# Altium schematic sheet Microcontroller.SchDoc
size A; SheetNumber: 1; SheetTotal: 9
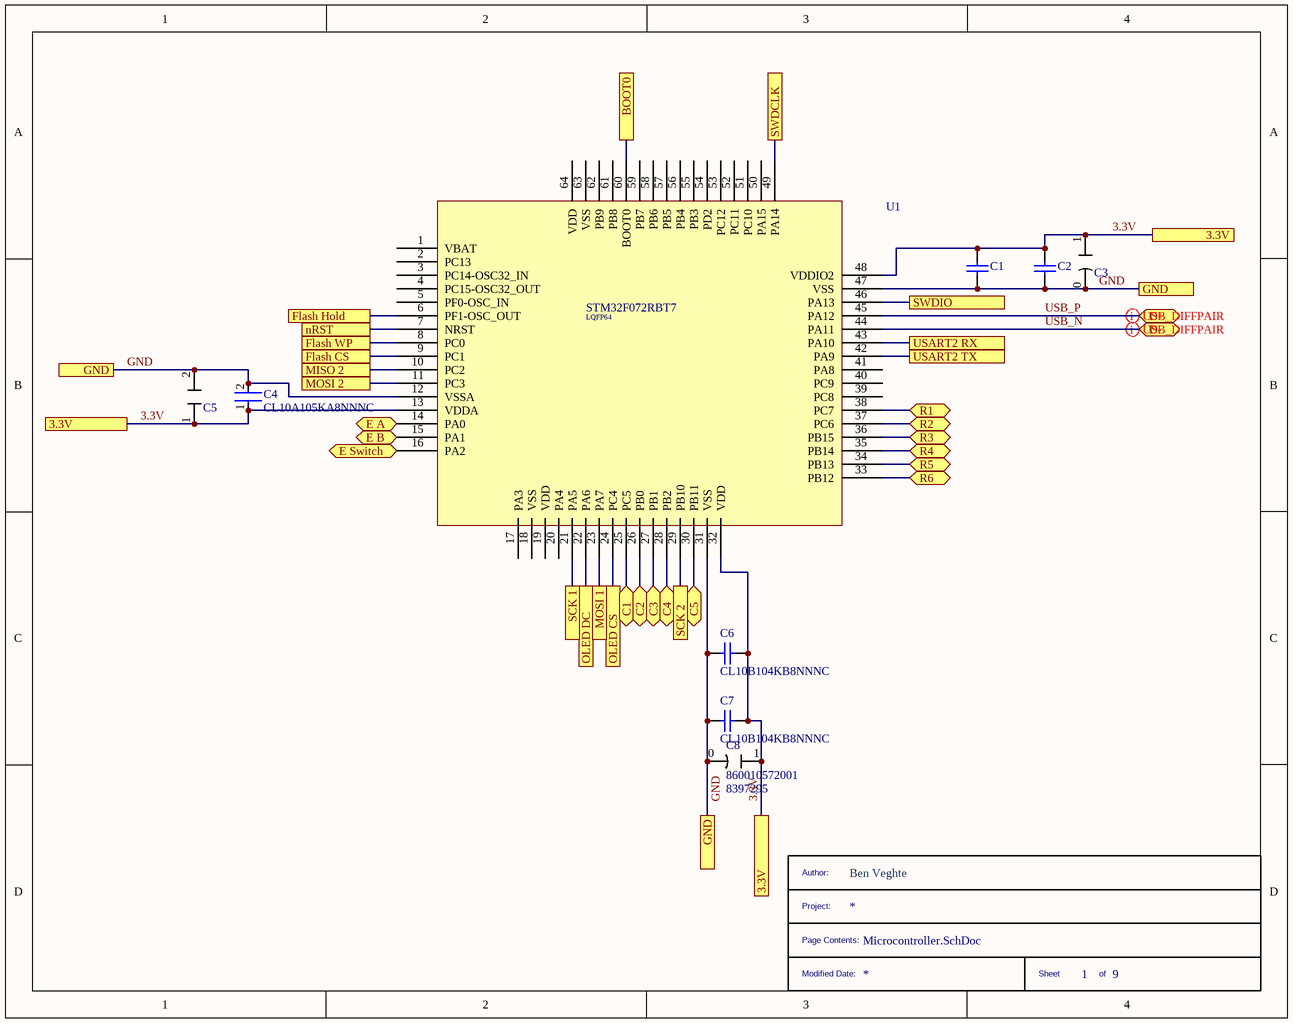
[diagram p0: Microcontroller.SchDoc]

## Parts
*  __TITLE_BLOCK__  (value not drawn)  (graphical)
C1  CL10B104KB8NNNC  [SAMS-C0603-2_M]  (value not drawn)
C2  CL10B104KB8NNNC  [SAMS-C0603-2_M]  (value not drawn)
C3  860010572001  [860010572001]  (value not drawn)
C4  CL10A105KA8NNNC  [FP-CL10-IPC_C]
C5  CL10B103KB8NNNC  [CL10B103KB8NNNC]  (value not drawn)
C6  CL10B104KB8NNNC  [SAMS-C0603-2_M]
C7  CL10B104KB8NNNC  [SAMS-C0603-2_M]
C8  860010572001  Supplier Part Number 1: 8397295  [860010572001]
U1  STM32F072RBT7  [STM32F072RBT6]  (value not drawn)

## Ports
3.3V, BOOT0, C1 (bidir), C2 (bidir), C3 (bidir), C4 (bidir), C5 (bidir), D+ (bidir), D- (bidir), E A (bidir), E B (bidir), E Switch (bidir), Flash CS, Flash Hold, Flash WP, GND, MISO 2, MOSI 1, MOSI 2, nRST, OLED CS, OLED DC, R1 (bidir), R2 (bidir), R3 (bidir), R4 (bidir), R5 (bidir), R6 (bidir), SCK 1, SCK 2, SWDCLK, SWDIO, USART2 RX, USART2 TX

## Nets
3.3V: C1.2 C2.2 C3.1 C4.1 C5.1 C6.2 C7.2 C8.1 U1.13(VDDA) U1.32(VDD) U1.48(VDDIO2) ; port 3.3V
BOOT0: U1.60(BOOT0) ; port BOOT0
C1: U1.25(PC5) ; port C1
C2: U1.26(PB0) ; port C2
C3: U1.27(PB1) ; port C3
C4: U1.28(PB2) ; port C4
C5: U1.30(PB11) ; port C5
E A: U1.14(PA0) ; port E A
E B: U1.15(PA1) ; port E B
E Switch: U1.16(PA2) ; port E Switch
Flash CS: U1.9(PC1) ; port Flash CS
Flash Hold: U1.6(PF1-OSC_OUT) ; port Flash Hold
Flash WP: U1.8(PC0) ; port Flash WP
GND: C1.1 C2.1 C3.0 C4.2 C5.2 C6.1 C7.1 C8.0 U1.12(VSSA) U1.31(VSS) U1.47(VSS) ; port GND
MISO 2: U1.10(PC2) ; port MISO 2
MOSI 1: U1.23(PA7) ; port MOSI 1
MOSI 2: U1.11(PC3) ; port MOSI 2
nRST: U1.7(NRST) ; port nRST
OLED CS: U1.24(PC4) ; port OLED CS
OLED DC: U1.22(PA6) ; port OLED DC
R1: U1.38(PC7) ; port R1
R2: U1.37(PC6) ; port R2
R3: U1.36(PB15) ; port R3
R4: U1.35(PB14) ; port R4
R5: U1.34(PB13) ; port R5
R6: U1.33(PB12) ; port R6
SCK 1: U1.21(PA5) ; port SCK 1
SCK 2: U1.29(PB10) ; port SCK 2
SWDCLK: U1.49(PA14) ; port SWDCLK
SWDIO: U1.46(PA13) ; port SWDIO
USART2 RX: U1.43(PA10) ; port USART2 RX
USART2 TX: U1.42(PA9) ; port USART2 TX
USB_N: U1.44(PA11) ; port D-
USB_P: U1.45(PA12) ; port D+

Not connected (* = marked no-connect by the designer): U1 1(VBAT) 2(PC13) 3(PC14-OSC32_IN) 4(PC15-OSC32_OUT) 5(PF0-OSC_IN) 17(PA3) 18(VSS) 19(VDD) 20(PA4) 39(PC8) 40(PC9) 41(PA8) 50(PA15) 51(PC10) 52(PC11) 53(PC12) 54(PD2) 55(PB3) 56(PB4) 57(PB5) 58(PB6) 59(PB7) 61(PB8) 62(PB9) 63(VSS) 64(VDD)

## Layout directives
differential pair: USB_N, USB_P

## Notes on the sheet
- (in symbol __TITLE_BLOCK__) Author:; Ben Veghte; Project:; Page Contents:; Modified Date:; Sheet; of
- (in symbol STM32F072RBT7) LQFP64

## Library data of the parts
C1 C2 C6 C7 = CMP-2000-05332-1: Multi-layer Ceramic Capacitor, -55 to 125 degC, 2-Pin SMD (0603), RoHS, Tape and Reel; Manufacturer: Samsung Electro-Mechanics; Capacitance: 0.1µF; Rated Voltage: 50V; Dielectric: X7R; Tolerance (%): ±10%; Case Size/Dimension: 0603; Datasheet URL: https://datasheet.ciiva.com/29198/456651-da-01-en-vs-kondensator-0605-29198839.pdf; Manufacturer URL: http://www.samsungsem.com/global/index.jsp; Datasheet Version: Nov-10
C3 C8 = 860010572001: Aluminium Electrolytic Capacitor, Wcap-Atg8 Series, 4.7 F, 20%, 35 V, 5 Mm, Radial Leaded Rohs Compliant: Yes; Manufacturer: Wurth Electronics; Voltage Rating: 35V; Polarity: Polar; Ripple Current: 44mA; Life (Hours): 2000Hour; Capacitance: 4.7uF; Supplier 1: RSComponents; Manufacturer Part Number: 860010572001; RoHS: Yes; Category: Aluminum Electrolytic Capacitors; Stock 1: 1; Pricing 1: 50=0.09100, 250=0.06400, 500=0.05100, 1000=0.04900 (USD); Mount: Through Hole; Case/Package: Radial; Min Operating Temperature: -40°C; Max Operating Temperature: 85°C; Package Quantity: 2000; Packaging: Tape and Reel; Tolerance: 20%; Voltage Rating (DC): 35V; Diameter: 5mm; Height: 11mm; Lead Pitch: 0.079inch; Height - Seated (Max): 0.492inch; REACH SVHC: Unknown; RoHS Compliant: Yes; ComponentLink1URL: http://www.farnell.com/datasheets/1879541.pdf?src-supplier=Farnell; ComponentLink1Description: http://www.farnell.com/datasheets/1879541.pdf?src-supplier=Farnell; ComponentLink2URL: http://www.farnell.com/datasheets/1879541.pdf?src-supplier=Element14; ComponentLink2Description: http://www.farnell.com/datasheets/1879541.pdf?src-supplier=Element14; ComponentLink3URL: https://katalog.we-online.de/pbs/datasheet/860010572001.pdf?src-supplier=Digi-Key; ComponentLink3Description: https://katalog.we-online.de/pbs/datasheet/860010572001.pdf?src-supplier=Digi-Key; ComponentLink4URL: http://katalog.we-online.de/pbs/datasheet/860010572001.pdf?src-supplier=Digi-Key; ComponentLink4Description: http://katalog.we-online.de/pbs/datasheet/860010572001.pdf?src-supplier=Digi-Key
  C3: Supplier Part Number 1: 8397295
C4 = CMP-13271-004127-1: Cap Ceramic 1uF 25V X5R ±10% Pad SMD 0603 +85°C T/R; Height: 0.8mm; Capacitance: 1uF; Depth: 0.8mm; Package Quantity: 1; Mount: Surface Mount; Contact Plating: Tin; Voltage Rating: 25V; Dielectric: X5R; Packaging: Tape and Reel; Material: Ceramic; Case Code (Metric): 1608; Length: 1.6mm; Voltage: 25V; Min Operating Temperature: -55°C; Width: 0.031inch; Tolerance: 10%; Case/Package: 0603; Radiation Hardening: No; Case Code (Imperial): 0603; Thickness: 0.035inch; Lead Free: Lead Free; Max Operating Temperature: 85°C; Voltage Rating (DC): 25V
C5 = CL10B103KB8NNNC: CAP CER 10000PF 50V X7R 0603; Manufacturer: Samsung; Material: Ceramic; Capacitance: 10nF; Tolerance: 10%; Supplier 1: Arrow Electronics; Manufacturer Part Number: CL10B103KB8NNNC; RoHS: Yes; Category: Ceramic Capacitors; Stock 1: 4784000; Pricing 1: 4000=0.00480, 8000=0.00470, 12000=0.00440, 40000=0.00350 (USD); Mount: Surface Mount; Case/Package: 0603; Case Code (Metric): 1608; Case Code (Imperial): 0603; Contact Plating: Tin; Min Operating Temperature: -55°C; Max Operating Temperature: 125°C; Dielectric: X7R; Voltage Rating: 50V; Package Quantity: 1; Packaging: Tape and Reel; Voltage: 50V; Voltage Rating (DC): 50V; Series: CL; Construction: Flat; Length: 1.6mm; Width: 0.031inch; Height: 0.8mm; Depth: 0.8mm; Thickness: 0.035inch; Radiation Hardening: No; Lead Free: Lead Free; RoHS Compliant: Yes; ComponentLink1URL: https://datasheet.ciiva.com/15195/getdatasheetpartid-357415-15195721.pdf?src-supplier=Verical; ComponentLink1Description: https://datasheet.ciiva.com/15195/getdatasheetpartid-357415-15195721.pdf?src-supplier=Verical; ComponentLink2URL: https://datasheet.ciiva.com/29198/457455-da-01-en-vs-kondensator-0603-29198644.pdf?src-supplier=Conrad; ComponentLink2Description: https://datasheet.ciiva.com/29198/457455-da-01-en-vs-kondensator-0603-29198644.pdf?src-supplier=Conrad; Supplier Part Number 1: CL10B103KB8NNNC
U1 = STM32F072RBT7: MCU 32-Bit ARM Cortex-M0 RISC 64KB Flash 2V to 3.6V 64-Pin LQFP Tray; Manufacturer: STMicroelectronics; Interface: I2C,SPI,USB,HDMI,IrDA,UART,USART; Peripherals: POR,PWM,WDT,DMA; Frequency: 48MHz; Number of I/Os: 51; Memory Size: 128KB; Oscillator Type: Internal; Supplier 1: Newark; Manufacturer Part Number: STM32F072RBT7; RoHS: Yes; Category: Microcontrollers; Stock 1: 885; Pricing 1: 1=7.63000, 10=6.86000, 25=6.49000, 50=6.05000, 100=5.62000, 250=5.10000, 500=4.79000 (USD); Case/Package: LQFP; Min Operating Temperature: -40°C; Max Operating Temperature: 105°C; Memory Type: FLASH; Packaging: Tray; Core Architecture: ARM; ComponentLink1URL: http://www.st.com/content/ccc/resource/technical/document/datasheet/cd/46/43/83/22/d3/40/c8/DM00090510.pdf/files/DM00090510.pdf/jcr:content/translations/en.DM00090510.pdf?src-supplier=Digi-Key; ComponentLink1Description: http://www.st.com/content/ccc/resource/technical/document/datasheet/cd/46/43/83/22/d3/40/c8/DM00090510.pdf/files/DM00090510.pdf/jcr:content/translations/en.DM00090510.pdf?src-supplier=Digi-Key